# Altium schematic sheet Power Regulation and Protection.SCHDOC
size A4
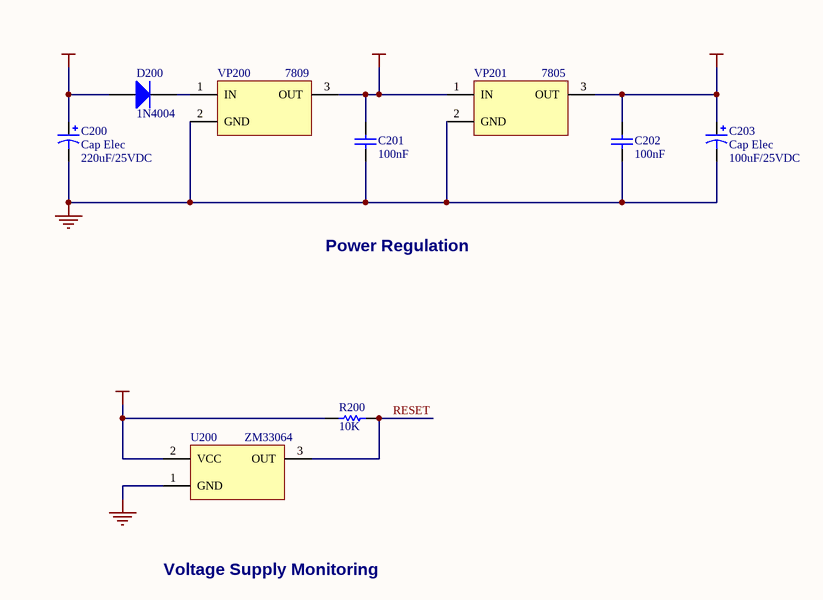
[diagram p0: Power Regulation and Protection.SCHDOC]

## Parts
C200  Cap Elec  value 220uF/25VDC  [CAPR5-4X5]
C201  100nF  [BCY-W2/D3.1]
C202  100nF  [BCY-W2/D3.1]
C203  Cap Elec  value 100uF/25VDC  [CAPR5-4X5]
D200  1N4004  [DIO10.46-5.3x2.8]
R200  10K  [AXIAL-0.3]
U200  ZM33064  [BCY-W3]
VP200  7809  [PIN3]
VP201  7805  [PIN3]

## Nets
5V: C202.2 C203.1 R200.2 U200.2(VCC) VP201.3(OUT)
9V: C201.2 VP200.3(OUT) VP201.1(IN)
10-12V IN: C200.1 D200.1(A)
GND: C200.2 C201.1 C202.1 C203.2 U200.1(GND) VP200.2(GND) VP201.2(GND)
RESET: R200.1 U200.3(OUT)
NetD200_2: D200.2(K) VP200.1(IN)

## Notes on the sheet
- Power Regulation
- Voltage Supply Monitoring

## Library data of the parts
C200 C203 = Cap Pol2: Polarized Capacitor (Axial); Published: 8-Jun-2000; Revision: July-2002: Re-released for DXP Platform.; Publisher: Altium Limited
C201 C202 = Cap: Capacitor; Published: 8-Jun-2000; Revision: July-2002: Re-released for DXP Platform.; Publisher: Altium Limited
D200 = Diode 1N4004: 1 Amp General Purpose Rectifier; Revision 1: 11-Jul-2000: SIM Model Added.; Revision 2: 17-Jul-2002: Re-released for DXP Platform.; Package Information: Latest Revision: Aug-1999; Code - JEDEC: DO-204-AL; Published: 8-Jun-2000; Datasheet: Latest Revision: 1998; Package Reference: DO-41; Publisher: Altium Limited
R200 = Res1: Resistor; Published: 8-Jun-2000; Revision: July-2002: Re-released for DXP Platform.; Publisher: Altium Limited
U200 = ZM33064: Generic 5V Supply Voltage Monitor
VP200 = 7809: Generic 9V Voltage Regulator
VP201 = 7805: Generic 6V Voltage Regulator